# Altium schematic sheet DM3370_OV9782_1-2.SchDoc: =project_title
size Tabloid; PageSetup: Record=PageOptions|CenterHorizontal=True|CenterVertical=True|PrintScale=0.71|XCorrection=1.00|YCorrection=1.00|PrintKind=0|BorderSize=5000000|LeftOffset=0|BottomOffset=0|Orientation=2|PaperLength=1000|PaperWidth=1000|Scale=100|PaperSource=7|PrintQuality=-4|MediaType=1|DitherType=10|PrintScaleMode=1|PaperKind=A4; CompanyName: Luxonis Holding; Organization: Luxonis Holding; Address1: 1925 Harmony Park Drive; Address2: Westminster, CO; Address3: 80234; Address4: United States; DocumentNumber: 9; SheetNumber: 9; SheetTotal: 17
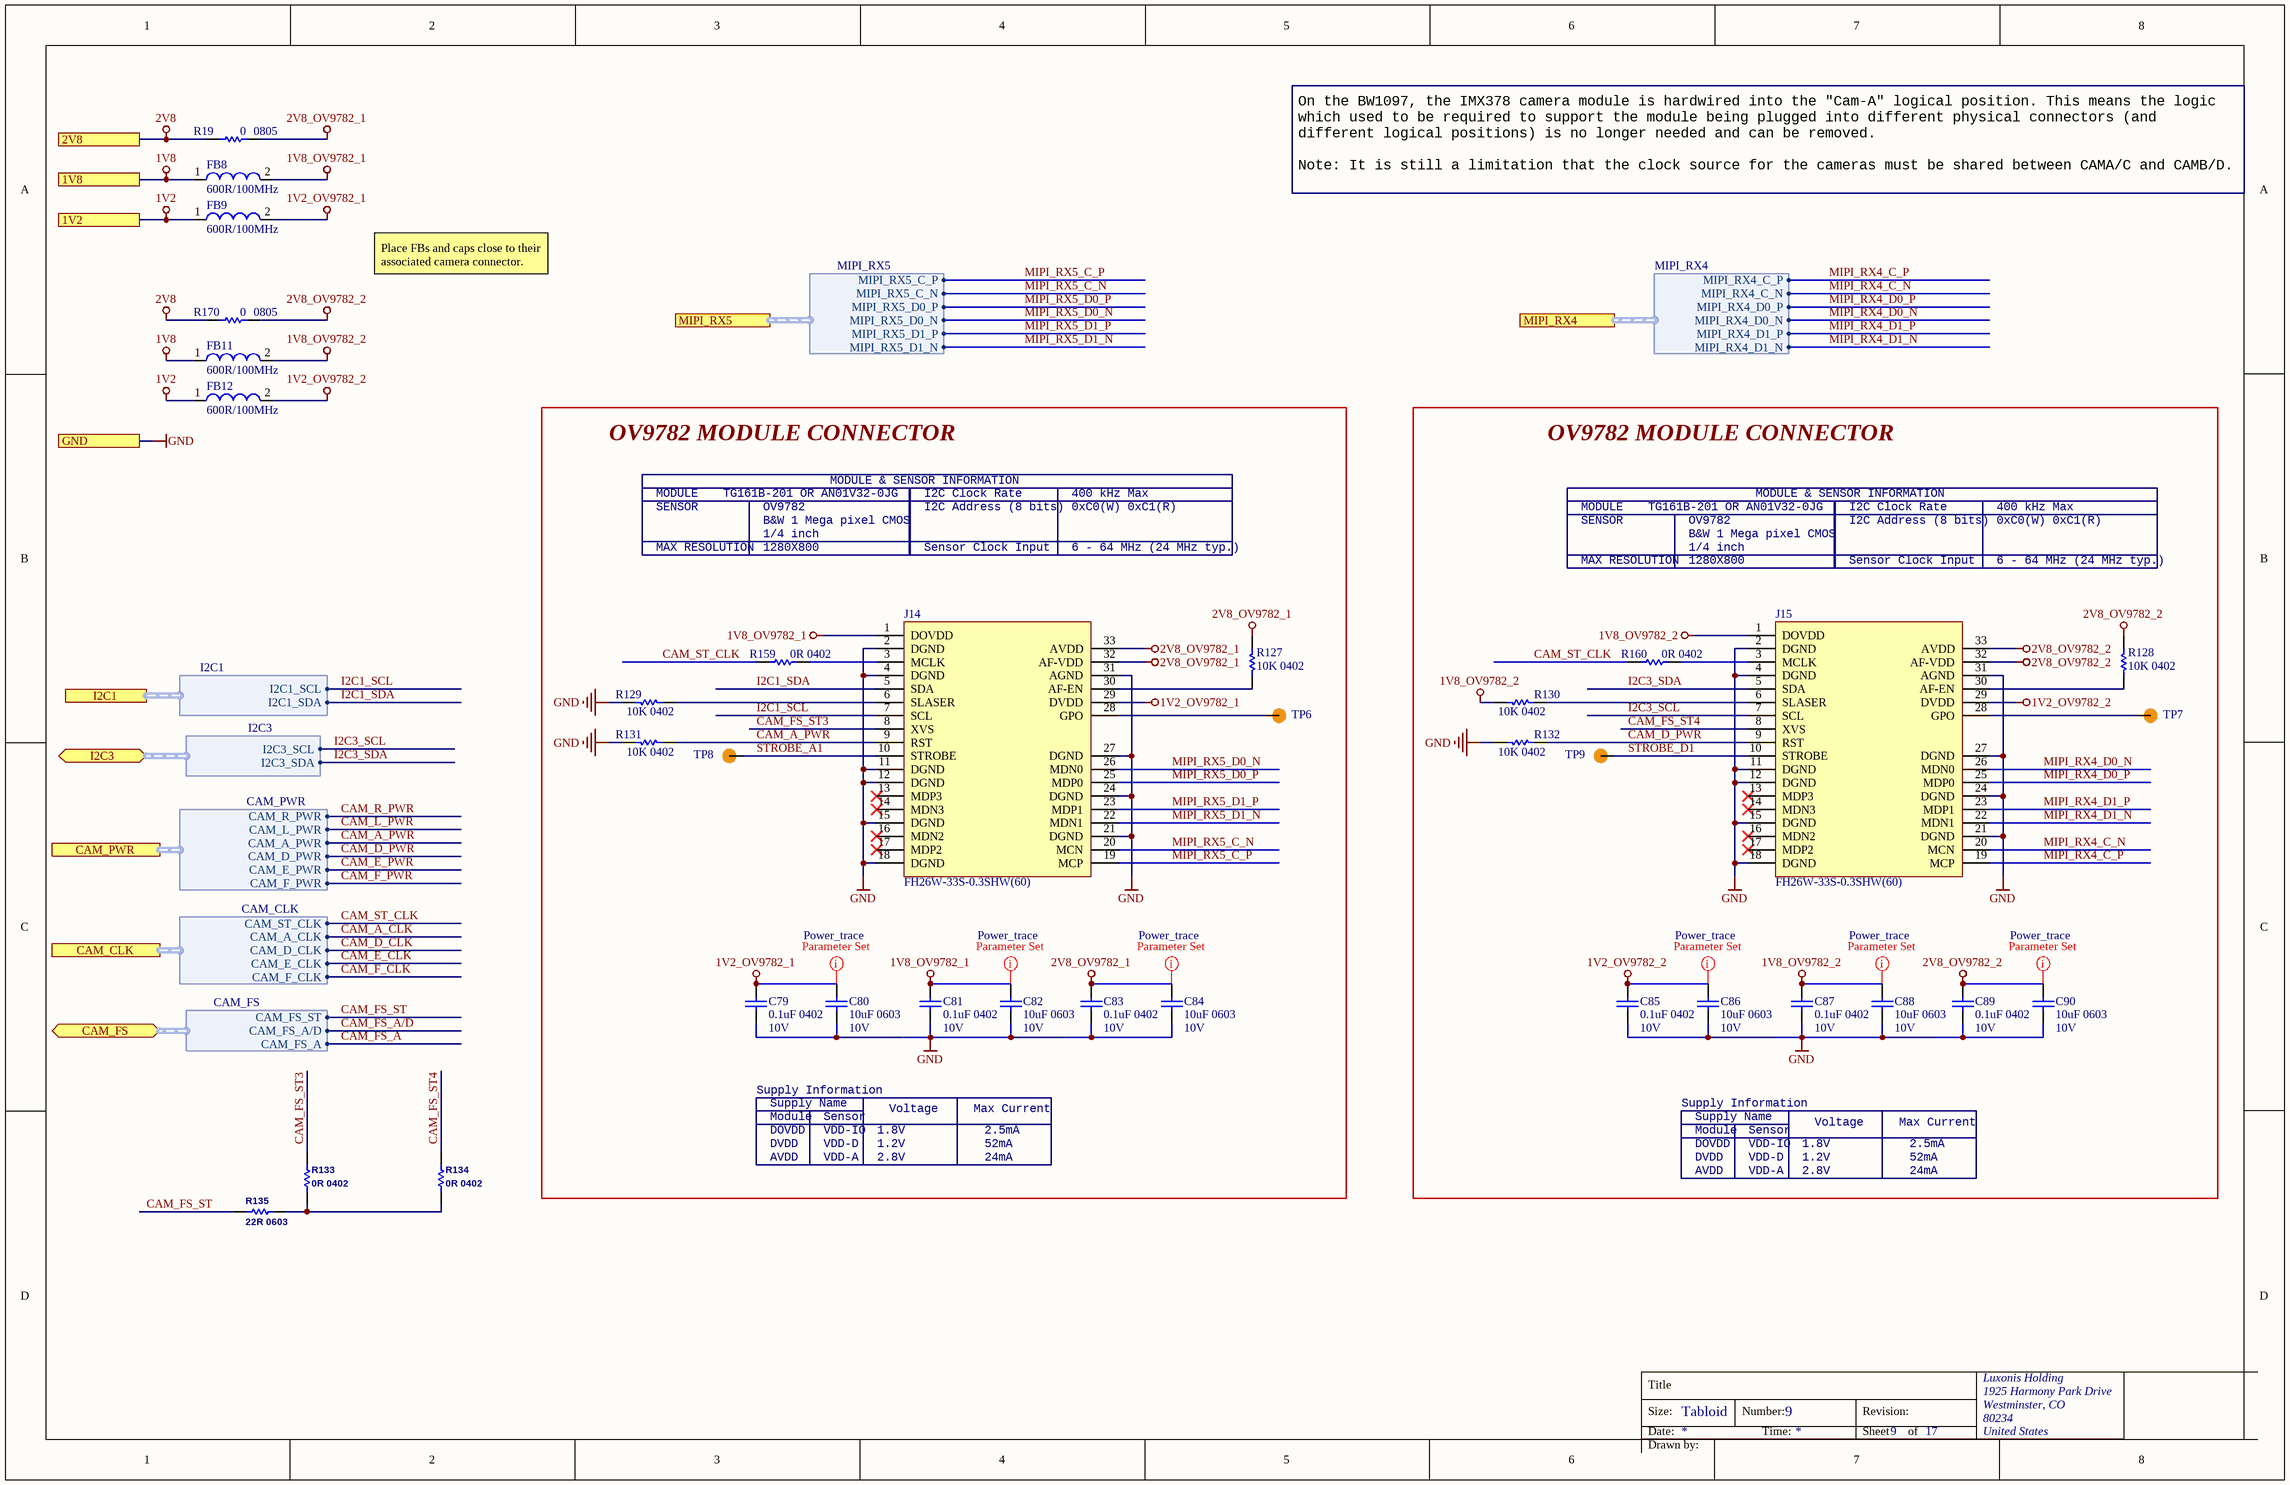
[diagram p0: DM3370_OV9782_1-2.SchDoc]

## Parts
C79  0.1uF 0402  Voltage Rating: 10V  [CAPC0402(1005)70_L]
C80  10uF 0603  Voltage Rating: 10V  [CAPC0603(1608)100_L]
C81  0.1uF 0402  Voltage Rating: 10V  [CAPC0402(1005)70_L]
C82  10uF 0603  Voltage Rating: 10V  [CAPC0603(1608)100_L]
C83  0.1uF 0402  Voltage Rating: 10V  [CAPC0402(1005)70_L]
C84  10uF 0603  Voltage Rating: 10V  [CAPC0603(1608)100_L]
C85  0.1uF 0402  Voltage Rating: 10V  [CAPC0402(1005)70_L]
C86  10uF 0603  Voltage Rating: 10V  [CAPC0603(1608)100_L]
C87  0.1uF 0402  Voltage Rating: 10V  [CAPC0402(1005)70_L]
C88  10uF 0603  Voltage Rating: 10V  [CAPC0603(1608)100_L]
C89  0.1uF 0402  Voltage Rating: 10V  [CAPC0402(1005)70_L]
C90  10uF 0603  Voltage Rating: 10V  [CAPC0603(1608)100_L]
FB8  600R/100MHz  [2508056017Y2]
FB9  600R/100MHz  [2508056017Y2]
FB11  600R/100MHz  [2508056017Y2]
FB12  600R/100MHz  [2508056017Y2]
J14  FH26W-33S-0.3SHW(60)  [FH26W-33S-0.3SHW(60)]
J15  FH26W-33S-0.3SHW(60)  [FH26W-33S-0.3SHW(60)]
R19  value 0  Case/Package: 0805  [RESC0805(2012)_L]  (hidden comment: CRCW08050000Z0EA)
R127  10K 0402  [RESC0402(1005)_L]
R128  10K 0402  [RESC0402(1005)_L]
R129  10K 0402  [RESC0402(1005)_L]
R130  10K 0402  [RESC0402(1005)_L]
R131  10K 0402  [RESC0402(1005)_L]
R132  10K 0402  [RESC0402(1005)_L]
R133  0R 0402  [RESC0402(1005)_L]
R134  0R 0402  [RESC0402(1005)_L]
R135  22R 0603  [RESC0603(1608)_L]
R159  0R 0402  [RESC0402(1005)_L]
R160  0R 0402  [RESC0402(1005)_L]
R170  value 0  Case/Package: 0805  [RESC0805(2012)_L]  (hidden comment: CRCW08050000Z0EA)
TP6  TP100_200_NS  [TP100_200_NS]  (value not drawn)  (no BOM)
TP7  TP100_200_NS  [TP100_200_NS]  (value not drawn)  (no BOM)
TP8  TP100_200_NS  [TP100_200_NS]  (value not drawn)  (no BOM)
TP9  TP100_200_NS  [TP100_200_NS]  (value not drawn)  (no BOM)

## Blocks framed on the sheet
OV9782 MODULE CONNECTOR: C79-C84 J14 R127 R129 R131 R159 TP6 TP8
OV9782 MODULE CONNECTOR: C85-C90 J15 R128 R130 R132 R160 TP7 TP9

## Ports
1V2, 1V8, 2V8, CAM_CLK (harness CAM_CLK), CAM_FS (bidir, harness CAM_FS), CAM_PWR (harness CAM_PWR), GND, I2C1 (harness I2C1), I2C3 (bidir, harness I2C3), MIPI_RX4 (harness MIPI_RX4), MIPI_RX5 (harness MIPI_RX5)

## Harnesses
I2C1: I2C1_SDA, I2C1_SCL
CAM_PWR: CAM_R_PWR, CAM_L_PWR, CAM_A_PWR, CAM_D_PWR, CAM_E_PWR, CAM_F_PWR
CAM_CLK: CAM_ST_CLK, CAM_A_CLK, CAM_D_CLK, CAM_E_CLK, CAM_F_CLK
CAM_FS: CAM_FS_ST, CAM_FS_A/D, CAM_FS_A
I2C3: I2C3_SCL, I2C3_SDA
MIPI_RX4: MIPI_RX4_C_P, MIPI_RX4_C_N, MIPI_RX4_D0_P, MIPI_RX4_D0_N, MIPI_RX4_D1_P, MIPI_RX4_D1_N
MIPI_RX5: MIPI_RX5_C_P, MIPI_RX5_C_N, MIPI_RX5_D0_P, MIPI_RX5_D0_N, MIPI_RX5_D1_P, MIPI_RX5_D1_N

## Nets
1V2: FB9.1 FB12.1 ; port 1V2
1V2_OV9782_1: C79.2 C80.2 FB9.2 J14.29(DVDD)
1V2_OV9782_2: C85.2 C86.2 FB12.2 J15.29(DVDD)
1V8: FB8.1 FB11.1 ; port 1V8
1V8_OV9782_1: C81.2 C82.2 FB8.2 J14.1(DOVDD)
1V8_OV9782_2: C87.2 C88.2 FB11.2 J15.1(DOVDD) R130.2
2V8: R19.1 R170.1 ; port 2V8
2V8_OV9782_1: C83.2 C84.2 J14.32(AF-VDD) J14.33(AVDD) R19.2 R127.1
2V8_OV9782_2: C89.2 C90.2 J15.32(AF-VDD) J15.33(AVDD) R128.1 R170.2
GND: C79.1 C80.1 C81.1 C82.1 C83.1 C84.1 C85.1 C86.1 C87.1 C88.1 C89.1 C90.1 J14.2(DGND) J14.4(DGND) J14.11(DGND) J14.12(DGND) J14.15(DGND) J14.18(DGND) J14.21(DGND) J14.24(DGND) J14.27(DGND) J14.31(AGND) J15.2(DGND) J15.4(DGND) J15.11(DGND) J15.12(DGND) J15.15(DGND) J15.18(DGND) J15.21(DGND) J15.24(DGND) J15.27(DGND) J15.31(AGND) R129.2 R131.2 R132.2 ; port GND
CAM_A_CLK: port CAM_CLK.CAM_A_CLK
CAM_A_PWR: J14.9(RST) R131.1 ; port CAM_PWR.CAM_A_PWR
CAM_D_CLK: port CAM_CLK.CAM_D_CLK
CAM_D_PWR: J15.9(RST) R132.1 ; port CAM_PWR.CAM_D_PWR
CAM_E_CLK: port CAM_CLK.CAM_E_CLK
CAM_E_PWR: port CAM_PWR.CAM_E_PWR
CAM_F_CLK: port CAM_CLK.CAM_F_CLK
CAM_F_PWR: port CAM_PWR.CAM_F_PWR
CAM_FS_A: port CAM_FS.CAM_FS_A
CAM_FS_A/D: port CAM_FS.CAM_FS_A/D
CAM_FS_ST: R135.2 ; port CAM_FS.CAM_FS_ST
CAM_FS_ST3: J14.8(XVS) R133.2
CAM_FS_ST4: J15.8(XVS) R134.2
CAM_L_PWR: port CAM_PWR.CAM_L_PWR
CAM_R_PWR: port CAM_PWR.CAM_R_PWR
CAM_ST_CLK: R159.1 R160.1 ; port CAM_CLK.CAM_ST_CLK
I2C1_SCL: J14.7(SCL) ; port I2C1.I2C1_SCL
I2C1_SDA: J14.5(SDA) ; port I2C1.I2C1_SDA
I2C3_SCL: J15.7(SCL) ; port I2C3.I2C3_SCL
I2C3_SDA: J15.5(SDA) ; port I2C3.I2C3_SDA
MIPI_RX4_C_N: J15.20(MCN) ; port MIPI_RX4.MIPI_RX4_C_N
MIPI_RX4_C_P: J15.19(MCP) ; port MIPI_RX4.MIPI_RX4_C_P
MIPI_RX4_D0_N: J15.26(MDN0) ; port MIPI_RX4.MIPI_RX4_D0_N
MIPI_RX4_D0_P: J15.25(MDP0) ; port MIPI_RX4.MIPI_RX4_D0_P
MIPI_RX4_D1_N: J15.22(MDN1) ; port MIPI_RX4.MIPI_RX4_D1_N
MIPI_RX4_D1_P: J15.23(MDP1) ; port MIPI_RX4.MIPI_RX4_D1_P
MIPI_RX5_C_N: J14.20(MCN) ; port MIPI_RX5.MIPI_RX5_C_N
MIPI_RX5_C_P: J14.19(MCP) ; port MIPI_RX5.MIPI_RX5_C_P
MIPI_RX5_D0_N: J14.26(MDN0) ; port MIPI_RX5.MIPI_RX5_D0_N
MIPI_RX5_D0_P: J14.25(MDP0) ; port MIPI_RX5.MIPI_RX5_D0_P
MIPI_RX5_D1_N: J14.22(MDN1) ; port MIPI_RX5.MIPI_RX5_D1_N
MIPI_RX5_D1_P: J14.23(MDP1) ; port MIPI_RX5.MIPI_RX5_D1_P
STROBE_A1: J14.10(STROBE) TP8.1
STROBE_D1: J15.10(STROBE) TP9.1
NetJ14_3: J14.3(MCLK) R159.2
NetJ14_6: J14.6(SLASER) R129.1
NetJ14_28: J14.28(GPO) TP6.1
NetJ14_30: J14.30(AF-EN) R127.2
NetJ15_3: J15.3(MCLK) R160.2
NetJ15_6: J15.6(SLASER) R130.1
NetJ15_28: J15.28(GPO) TP7.1
NetJ15_30: J15.30(AF-EN) R128.2
NetR133_1: R133.1 R134.1 R135.1

Not connected (* = marked no-connect by the designer): J14 13(MDP3)* 14(MDN3)* 16(MDN2)* 17(MDP2)*; J15 13(MDP3)* 14(MDN3)* 16(MDN2)* 17(MDP2)*

## Layout directives
net class Power_trace: 1V2_OV9782_1, 1V2_OV9782_2, 1V8_OV9782_1, 1V8_OV9782_2, 2V8_OV9782_1, 2V8_OV9782_2

## Notes on the sheet
- On the BW1097, the IMX378 camera module is hardwired into the "Cam-A" logical position. This means the logic which used to be required to support the module being plugged into different physical connectors (and different logical positions) is no longer needed and can be removed.
  Note: It is still a limitation that the clock source for the cameras must be shared between CAMA/C and CAMB/D.
- Place FBs and caps close to their associated camera connector.
- MODULE
- TG161B-201 OR AN01V32-0JG
- MODULE & SENSOR INFORMATION
- I2C Clock Rate
- 400 kHz Max
- SENSOR
- MAX RESOLUTION
- B&W 1 Mega pixel CMOS
- 1280X800
- OV9782
- 1/4 inch
- I2C Address (8 bits)
- Sensor Clock Input
- 6 - 64 MHz (24 MHz typ.)
- 0xC0(W) 0xC1(R)
- Supply Information
- Supply Name
- AVDD
- DOVDD
- DVDD
- Module
- VDD-A
- VDD-IO
- VDD-D
- Sensor
- 2.8V
- 1.8V
- 1.2V
- Voltage
- Max Current
- 24mA
- 2.5mA
- 52mA
- Title
- Size:
- Date:
- Tabloid
- Number:
- Time:
- Revision:
- Sheet
- of
- Drawn by:

## Library data of the parts
C79 C81 C83 C85 C87 C89 = GRM155R71A104JA01D: CAP CER 0.1UF 10V X7R 0402 5%; Manufacturer 1: Murata; Capacitance: 100nF; Manufacturer Part Number 1: GRM155R71A104JA01D; Supplier 1: Digi-Key; Stock 1: 1346709; Pricing 1: 1=0.10000, 10=0.02500, 100=0.01130, 500=0.00806, 1000=0.00633, 2500=0.00575, 5000=0.00529 (USD); RoHS: Yes; Mount: Surface Mount; Case/Package: 0402; Case Code (Imperial): 0402; Case Code (Metric): 1005; Min Operating Temperature: -55°C; Max Operating Temperature: 125°C; Tolerance: 5%; Packaging: Tape and Reel; Voltage Rating (DC): 10V; Dielectric: X7R; Package Quantity: 10000; Termination: SMD/SMT; Length: 1mm; Height: 0.5mm; Width: 0.02inch; Thickness: 0.022inch; Depth: 0.5mm; Radiation Hardening: No; Lead Free: Lead Free; ComponentLink1URL: https://datasheet.ciiva.com/5411/product-5411135.pdf?src-supplier=Mouser; ComponentLink1Description: https://datasheet.ciiva.com/5411/product-5411135.pdf?src-supplier=Mouser; ComponentLink2URL: https://datasheet.ciiva.com/11618/c02e-11618821.pdf?src-supplier=Avnet; ComponentLink2Description: https://datasheet.ciiva.com/11618/c02e-11618821.pdf?src-supplier=Avnet; Supplier Part Number 1: 490-10777-1-ND
C80 C82 C84 C86 C88 C90 = GRM188R61A106ME69D: CAP CER 10UF 10V X5R 0603 20%; Manufacturer 1: Murata; Material: Ceramic; Manufacturer Part Number 1: GRM188R61A106ME69D; Supplier 1: Digi-Key; Stock 1: 2873098; Pricing 1: 1=0.21000, 10=0.14100, 100=0.07130, 500=0.04876, 1000=0.04313 (USD); RoHS: Yes; Mount: Surface Mount; Case/Package: 0603; Weight: 0.000222oz; Case Code (Metric): 1608; Case Code (Imperial): 0603; Min Operating Temperature: -55°C; Max Operating Temperature: 85°C; Packaging: Tape and Reel; Tolerance: 20%; Capacitance: 10uF; Dielectric: X5R; Voltage Rating (DC): 10V; Package Quantity: 4000; Termination: SMD/SMT; Length: 1.6mm; Height: 0.8mm; Width: 0.8mm; Thickness: 0.035inch; Depth: 0.8mm; REACH SVHC: Unknown; Lead Free: Lead Free; ComponentLink1URL: http://www.mouser.com/ds/2/281/c02e-2905.pdf?src-supplier=Mouser; ComponentLink1Description: http://www.mouser.com/ds/2/281/c02e-2905.pdf?src-supplier=Mouser; ComponentLink2URL: http://components.arrow.com/part/dataview/0323_06119472?src-supplier=Arrow+Europe; ComponentLink2Description: http://components.arrow.com/part/dataview/0323_06119472?src-supplier=Arrow+Europe; ComponentLink3URL: http://www.farnell.com/datasheets/2048014.pdf?src-supplier=Farnell; ComponentLink3Description: http://www.farnell.com/datasheets/2048014.pdf?src-supplier=Farnell; ComponentLink4URL: http://www.farnell.com/datasheets/1872210.pdf?src-supplier=Farnell; ComponentLink4Description: http://www.farnell.com/datasheets/1872210.pdf?src-supplier=Farnell; ComponentLink5URL: http://search.murata.co.jp/Ceramy/image/img/A01X/G101/ENG/GRM188R61A106ME69-01.pdf?src-supplier=Digi-Key; ComponentLink5Description: http://search.murata.co.jp/Ceramy/image/img/A01X/G101/ENG/GRM188R61A106ME69-01.pdf?src-supplier=Digi-Key; ComponentLink6URL: http://www.farnell.com/datasheets/1872210.pdf?src-supplier=Newark; ComponentLink6Description: http://www.farnell.com/datasheets/1872210.pdf?src-supplier=Newark; ComponentLink7URL: http://www.farnell.com/datasheets/2048014.pdf?src-supplier=Element14; ComponentLink7Description: http://www.farnell.com/datasheets/2048014.pdf?src-supplier=Element14; ComponentLink8URL: http://www.farnell.com/datasheets/2048014.pdf?src-supplier=Newark; ComponentLink8Description: http://www.farnell.com/datasheets/2048014.pdf?src-supplier=Newark; Supplier Part Number 1: 490-10475-1-ND
FB8 FB9 FB11 FB12 = 2508056017Y2: FERRITE BEAD, 0.1OHM, 2A, 0805, 600R/100MHz; Manufacturer 1: Fair-Rite; Impedance: 600R; Tolerance: 25%; Resistance: 350mR; DC Resistance (DCR): 100mR; Test Frequency: 100MHz; Manufacturer Part Number 1: 2508056017Y2; Supplier 1: Digi-Key; Stock 1: 100491; Pricing 1: 1=0.10000, 10=0.07900, 25=0.07120, 50=0.05240, 100=0.04520, 250=0.03568, 500=0.03014, 1000=0.02538 (USD); RoHS: Yes; Case/Package: 0805; Number of Pins: 2; Case Code (Metric): 2012; Case Code (Imperial): 0805; Min Operating Temperature: -55°C; Max Operating Temperature: 125°C; Package Quantity: 4000; Packaging: Tape and Reel; Max DC Current: 2A; Termination: SMD/SMT; Military Standard: Not; DC Current: 2A; Current Rating: 2A; Frequency: 100MHz; Length: 2mm; Height: 0.9mm; Width: 1.25mm; Depth: 1.25mm; Radiation Hardening: No; REACH SVHC: No SVHC; ComponentLink1URL: https://datasheet.ciiva.com/3854/3802508056017y2-3854245.pdf?src-supplier=Arrow; ComponentLink1Description: https://datasheet.ciiva.com/3854/3802508056017y2-3854245.pdf?src-supplier=Arrow; ComponentLink2URL: https://datasheet.ciiva.com/22735/652149-22735047.pdf?src-supplier=Element14; ComponentLink2Description: https://datasheet.ciiva.com/22735/652149-22735047.pdf?src-supplier=Element14; ComponentLink3URL: https://datasheet.ciiva.com/1127/26143-1127514.pdf?src-supplier=Farnell; ComponentLink3Description: https://datasheet.ciiva.com/1127/26143-1127514.pdf?src-supplier=Farnell; ComponentLink4URL: https://datasheet.ciiva.com/18090/getdatasheetpartid-212640-18090187.pdf?src-supplier=Verical; ComponentLink4Description: https://datasheet.ciiva.com/18090/getdatasheetpartid-212640-18090187.pdf?src-supplier=Verical; ComponentLink5URL: https://datasheet.ciiva.com/7620/26143-7620140.pdf?src-supplier=Element14; ComponentLink5Description: https://datasheet.ciiva.com/7620/26143-7620140.pdf?src-supplier=Element14; Supplier Part Number 1: 1934-1487-1-ND
J14 J15 = CMP-002-00090-2: FFC/FPC Connector, 33 Contact(s), 1 Row(s), Female, Right Angle, Surface Mount Terminal; Manufacturer 1: Hirose; Design Item ID: FH26W-33S-0.3SHW(60); Stock 1: 627; ComponentLink2URL: https://www.hirose.com/product/en/download_file/key_name/FH26/category/Catalog/doc_file_id/49355/?file_category_id=4&item_id=298&is_series=1&src-supplier=Digi-Key; Category: FFC / FPC; ComponentLink3Description: https://www.hirose.com/product/download/?distributor=digikey&amp;type=2d&amp;lang=en&amp;num=FH26W-13S-0.3SHW(60)&src-supplier=Digi-Key; Manufacturer Part Number 1: FH26W-33S-0.3SHW(60); ComponentLink1Description: https://datasheet.ciiva.com:443/pdfs/VipMasterIC/IC/HIRO/HIRO-S-A0007913874/HIRO-S-A0008593114-1.pdf?src-supplier=IHS+Markit; ComponentLink1URL: https://datasheet.ciiva.com:443/pdfs/VipMasterIC/IC/HIRO/HIRO-S-A0007913874/HIRO-S-A0008593114-1.pdf?src-supplier=IHS+Markit; RoHS: Yes; ComponentLink3URL: https://www.hirose.com/product/download/?distributor=digikey&amp;type=2d&amp;lang=en&amp;num=FH26W-13S-0.3SHW(60)&src-supplier=Digi-Key; ComponentLink2Description: https://www.hirose.com/product/en/download_file/key_name/FH26/category/Catalog/doc_file_id/49355/?file_category_id=4&item_id=298&is_series=1&src-supplier=Digi-Key; Pricing 1: 1=1,78000, 10=1,61700, 25=1,51800, 50=1,45200, 100=1,38600, 250=1,25400, 500=1,15500, 1000=0,99000, 2500=0,92400 (USD); Source: LuxonisMaster.SchLib
R19 R170 = CMP-013-000034-9: RES SMD 0 OHM 1% 1/8W 0805; Manufacturer 1: Vishay; Power Rating: 125mW; Design Item ID: CRCW08050000Z0EA; Manufacturer Part Number 1: CRCW08050000Z0EA; Max Operating Temperature: 155°C; Min Operating Temperature: -55°C
R127-R132 = RC0402FR-1310KL: RES SMD 10K OHM 1% 0402 1/16W Chip Resistor, 0402 [1005 Metric], 10 kohm, RC Series, 50 V, Thick Film, 62.5 mW; Manufacturer 1: Yageo; Resistance: 10kR; Temperature Coefficient: 100ppm/°C; Power Rating: 62.5mW; Voltage Rating: 50V; ComponentLink1URL: https://datasheet.ciiva.com/16940/pyu-rc0402-51-rohs-l-6-16940293.pdf?src-supplier=Avnet+Europe; ComponentLink1Description: https://datasheet.ciiva.com/16940/pyu-rc0402-51-rohs-l-6-16940293.pdf?src-supplier=Avnet+Europe; ComponentLink2URL: https://datasheet.ciiva.com/28386/pyu-rc0402-51-rohs-l-6-28386855.pdf?src-supplier=Avnet+Europe; ComponentLink2Description: https://datasheet.ciiva.com/28386/pyu-rc0402-51-rohs-l-6-28386855.pdf?src-supplier=Avnet+Europe; ComponentLink3URL: https://datasheet.ciiva.com/16740/pyu-rc0402-51-rohs-l-6-r-16740602.pdf?src-supplier=Future+Electronics; ComponentLink3Description: https://datasheet.ciiva.com/16740/pyu-rc0402-51-rohs-l-6-r-16740602.pdf?src-supplier=Future+Electronics; ComponentLink4URL: https://datasheet.ciiva.com/8891/pyu-rc0402-51-rohs-l-6-8891339.pdf?src-supplier=Avnet; ComponentLink4Description: https://datasheet.ciiva.com/8891/pyu-rc0402-51-rohs-l-6-8891339.pdf?src-supplier=Avnet; ComponentLink5URL: https://datasheet.ciiva.com/5557/pyu-rc0402-51-rohs-l-6-r-5557997.pdf?src-supplier=Mouser; ComponentLink5Description: https://datasheet.ciiva.com/5557/pyu-rc0402-51-rohs-l-6-r-5557997.pdf?src-supplier=Mouser; ComponentLink6URL: https://datasheet.ciiva.com/7983/1018594-7983533.pdf?src-supplier=Element14; ComponentLink6Description: https://datasheet.ciiva.com/7983/1018594-7983533.pdf?src-supplier=Element14; Supplier 1: Newark; Manufacturer Part Number 1: RC0402FR-1310KL; Stock 1: 62239; Pricing 1: 1=0.10000, 25=0.01200, 100=0.00400, 250=0.00400, 500=0.00300, 1000=0.00300 (USD); RoHS: Yes; Case/Package: 0402; Number of Pins: 2; Contact Plating: Tin,Matte,Lead; Case Code (Imperial): 0402; Case Code (Metric): 1005; Min Operating Temperature: -55°C; Max Operating Temperature: 155°C; Tolerance: 1%; Composition: Thick Film; Packaging: Tape and Reel; Termination: SMD/SMT; Military Standard: Not; Voltage Rating (DC): 50V; Working Voltage: 50V; Number of Terminations: 2; Length: 1mm; Depth: 0.5mm; Radiation Hardening: No; REACH SVHC: No SVHC; Lead Free: Lead Free; Supplier Part Number 1: 67R9960; Supplier 2: Future Electronics; Supplier 3: Mouser; Supplier 4: Element14; Supplier Part Number 2: RC0402FR-1310KL-CUTT; Supplier Part Number 3: 603-RC0402FR-1310KL; Supplier Part Number 4: 1799235
R133 R134 R159 R160 = CRCW04020000Z0ED: RES SMD 0 OHM JUMPER 1/16W 0402; Manufacturer 1: Vishay; Resistance: 0mR; Power Rating: 63mW; Voltage Rating: 50V; Temperature Coefficient: 100ppm/°C; Tolerance: 5%; Supplier 1: Digi-Key; Manufacturer Part Number 1: CRCW04020000Z0ED; Stock 1: 855968; Pricing 1: 1=0.10000, 10=0.03400, 25=0.02440, 50=0.01860, 100=0.01380, 250=0.01048, 500=0.00840, 1000=0.00618, 5000=0.00443 (USD); RoHS: Yes; Mount: Surface Mount; Case/Package: 0402; Weight: 2.3E-05oz; Case Code (Imperial): 0402; Case Code (Metric): 1005; Contact Plating: Tin; Min Operating Temperature: -55°C; Max Operating Temperature: 155°C; Packaging: Tape and Reel; Composition: Thick Film; Voltage Rating (DC): 50V; Package Quantity: 1; Termination: SMD/SMT; Number of Terminations: 2; Military Standard: Not; Max Power Dissipation: 63mW; Features: Automotive AEC-Q200; Length: 1mm; Height: 0.35mm; Width: 0.5mm; Depth: 0.5mm; Radiation Hardening: No; REACH SVHC: Unknown; Lead Free: Lead Free; ComponentLink1URL: https://datasheet.ciiva.com/3255/dcrcwe3-3255944.pdf?src-supplier=Avnet; ComponentLink1Description: https://datasheet.ciiva.com/3255/dcrcwe3-3255944.pdf?src-supplier=Avnet; ComponentLink2URL: https://datasheet.ciiva.com/3255/dcrcwe3-3255945.pdf?src-supplier=Avnet; ComponentLink2Description: https://datasheet.ciiva.com/3255/dcrcwe3-3255945.pdf?src-supplier=Avnet; ComponentLink3URL: https://datasheet.ciiva.com/16881/dcrcwe3-16881413.pdf?src-supplier=Avnet+Europe; ComponentLink3Description: https://datasheet.ciiva.com/16881/dcrcwe3-16881413.pdf?src-supplier=Avnet+Europe; ComponentLink4URL: https://datasheet.ciiva.com/2461/dcrcwe3-2461962.pdf?src-supplier=Digi-Key; ComponentLink4Description: https://datasheet.ciiva.com/2461/dcrcwe3-2461962.pdf?src-supplier=Digi-Key; ComponentLink5URL: https://datasheet.ciiva.com/7841/1720486-7841802.pdf?src-supplier=Element14; ComponentLink5Description: https://datasheet.ciiva.com/7841/1720486-7841802.pdf?src-supplier=Element14; ComponentLink6URL: https://datasheet.ciiva.com/2461/dcrcwe3-2461963.pdf?src-supplier=Digi-Key; ComponentLink6Description: https://datasheet.ciiva.com/2461/dcrcwe3-2461963.pdf?src-supplier=Digi-Key; ComponentLink7URL: https://datasheet.ciiva.com/2461/dcrcwe3-2461964.pdf?src-supplier=Digi-Key; ComponentLink7Description: https://datasheet.ciiva.com/2461/dcrcwe3-2461964.pdf?src-supplier=Digi-Key; ComponentLink8URL: https://datasheet.ciiva.com/7841/1697337-7841468.pdf?src-supplier=Element14; ComponentLink8Description: https://datasheet.ciiva.com/7841/1697337-7841468.pdf?src-supplier=Element14; ComponentLink9URL: https://datasheet.ciiva.com/16761/70200976-16761309.pdf?src-supplier=Allied+Electronics; ComponentLink9Description: https://datasheet.ciiva.com/16761/70200976-16761309.pdf?src-supplier=Allied+Electronics; ComponentLink10URL: https://datasheet.ciiva.com/26311/fld-crcw-e3-data-en-26311550.pdf?src-supplier=Distrelec; ComponentLink10Description: https://datasheet.ciiva.com/26311/fld-crcw-e3-data-en-26311550.pdf?src-supplier=Distrelec; Supplier Part Number 1: 541-0.0JCT-ND
R135 = RC0603FR-0722RL: RES SMD 22 OHM 1% 1/10W 0603; Manufacturer 1: Yageo; Temperature Coefficient: 100ppm/°C; Power Rating: 100mW; Voltage Rating: 50V; Supplier 1: Digi-Key; Manufacturer Part Number 1: RC0603FR-0722RL; Stock 1: 3640176; Pricing 1: 1=0.10000, 10=0.02300, 100=0.00940, 1000=0.00421, 2500=0.00366 (USD); RoHS: Yes; Case/Package: 0603; Number of Pins: 2; Case Code (Metric): 1608; Case Code (Imperial): 0603; Min Operating Temperature: -55°C; Max Operating Temperature: 155°C; Tolerance: 1%; Resistance: 22R; Packaging: Tape and Reel; Composition: Thick Film; Voltage Rating (DC): 50V; Package Quantity: 1; Termination: SMD/SMT; Military Standard: Not; Number of Terminations: 2; Max Power Dissipation: 100mW; Features: Moisture Resistant; Length: 1.6mm; Height: 0.022inch; Width: 0.031inch; Depth: 0.8mm; REACH SVHC: No SVHC; Lead Free: Lead Free; ComponentLink1URL: https://datasheet.ciiva.com/11819/0900766b80f96399-11819285.pdf?src-supplier=RSComponents; ComponentLink1Description: https://datasheet.ciiva.com/11819/0900766b80f96399-11819285.pdf?src-supplier=RSComponents; ComponentLink2URL: https://datasheet.ciiva.com/2454/pyu-r-int-thick-7-2454354.pdf?src-supplier=Digi-Key; ComponentLink2Description: https://datasheet.ciiva.com/2454/pyu-r-int-thick-7-2454354.pdf?src-supplier=Digi-Key; ComponentLink3URL: https://datasheet.ciiva.com/2454/pyu-r-int-thick-7-2454355.pdf?src-supplier=Digi-Key; ComponentLink3Description: https://datasheet.ciiva.com/2454/pyu-r-int-thick-7-2454355.pdf?src-supplier=Digi-Key; ComponentLink4URL: https://datasheet.ciiva.com/2454/pyu-r-int-thick-7-2454356.pdf?src-supplier=Digi-Key; ComponentLink4Description: https://datasheet.ciiva.com/2454/pyu-r-int-thick-7-2454356.pdf?src-supplier=Digi-Key; ComponentLink5URL: https://datasheet.ciiva.com/46440/1868787-46440901.pdf?src-supplier=Element14; ComponentLink5Description: https://datasheet.ciiva.com/46440/1868787-46440901.pdf?src-supplier=Element14; ComponentLink6URL: https://datasheet.ciiva.com/46395/443971-46395032.pdf?src-supplier=Element14; ComponentLink6Description: https://datasheet.ciiva.com/46395/443971-46395032.pdf?src-supplier=Element14; Supplier 2: Newark; Supplier 3: Mouser; Supplier Part Number 2: 26M6754; Supplier Part Number 3: 603-RC0603FR-0722RL; Supplier Part Number 1: 311-22.0HRCT-ND
TP6-TP9 = TEST_POINT